# EAGLE design sensor_board4 (EAGLE 7.3.0)
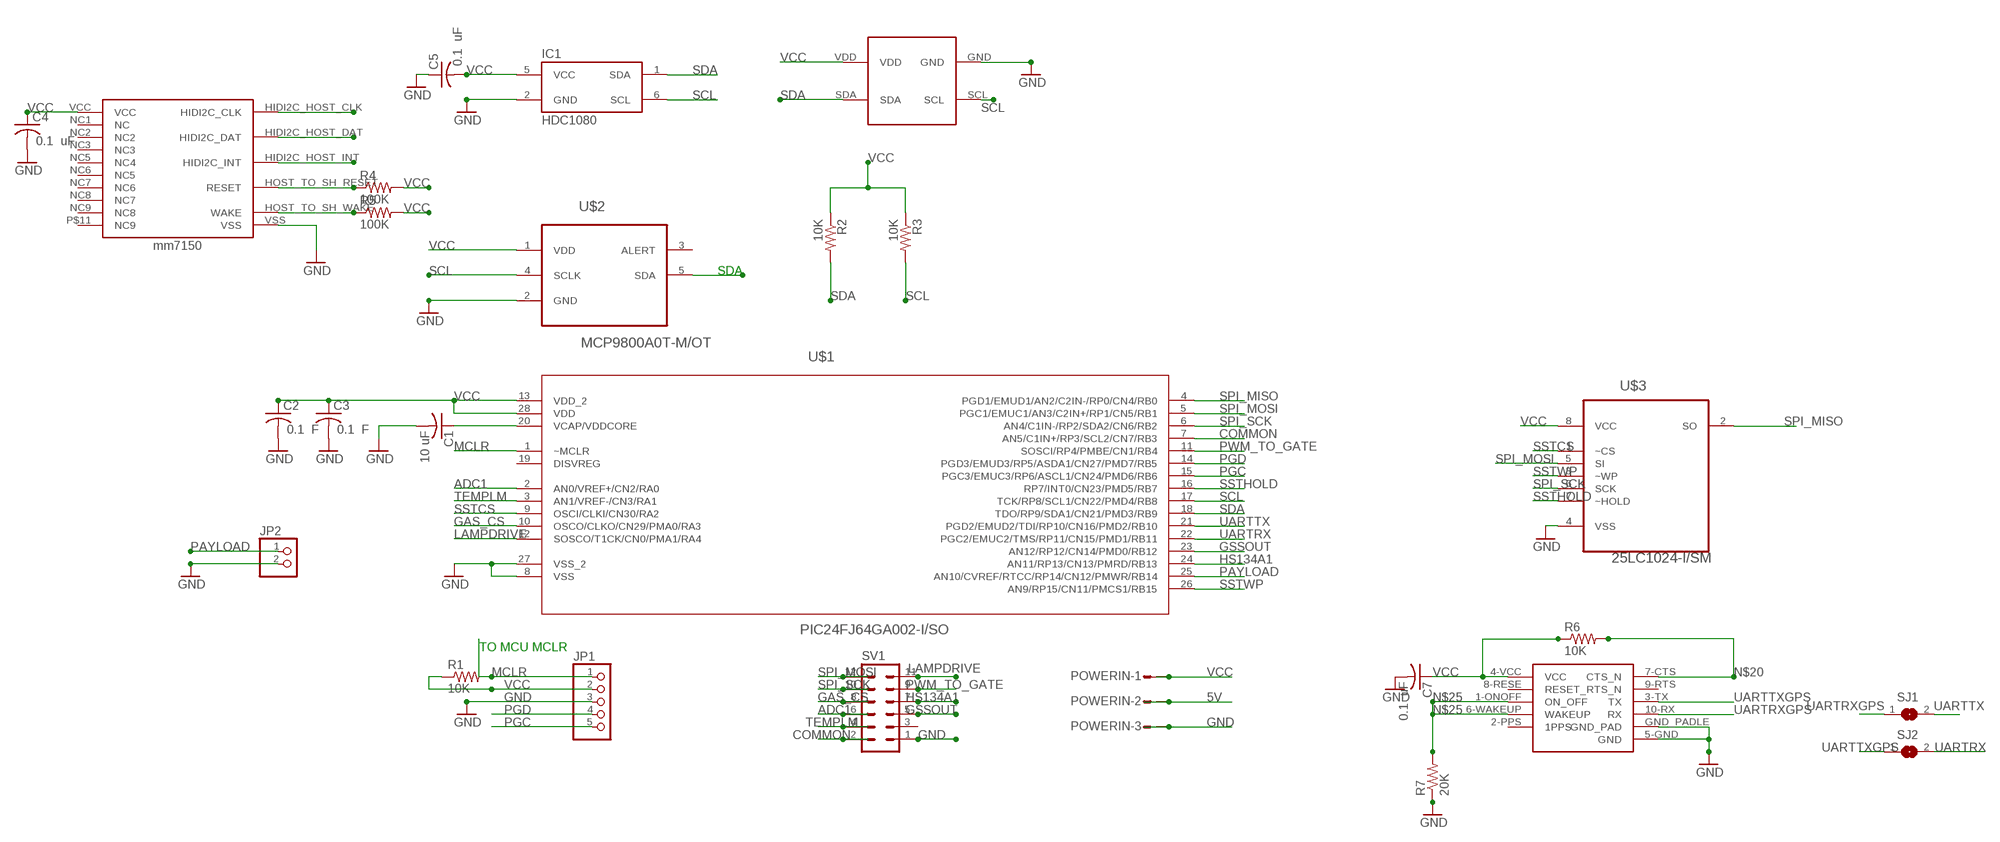
[diagram p0: schematic, sheet 1]

## Parts
C1  10 uF  C-USC0805  [C0805]
C2  0.1 F  C-USC0805  [C0805]
C3  0.1 F  C-USC0805  [C0805]
C4  0.1 uF  C-USC0805  [C0805]
C5  0.1 uF  C-USC0805  [C0805]
C7  0.1 uF  C-USC0805  [C0805]
IC1  HDC1080  [WSON6]
JP1  PINHD-1X5  [1X05]
JP2  PINHD-1X2  [1X02]
POWERIN  L03P  [L03P]
R1  10K  R-US_M0805  [M0805]
R2  10K  R-US_M0805  [M0805]
R3  10K  R-US_M0805  [M0805]
R4  100K  R-US_M0805  [M0805]
R5  100K  R-US_M0805  [M0805]
R6  10K  R-US_M0805  [M0805]
R7  20K  R-US_M0805  [M0805]
SJ1  SJ  [SJ]
SJ2  SJ  [SJ]
SV1  MA06-2  [MA06-2]
U$1  PIC24FJ64GA002-I/SO  [SOIC127P1030X265-28N]
U$2  MCP9800A0T-M/OT  [SOT95P280X145-5N]
U$3  25LC1024-I/SM  [SOIC127P794X203-8N]
U$4  MS5637  [MS5637]
U$5  ORG1411  [LGA]
U$6  MM7150  [MM7150-QFN16]

## Nets
5V: POWERIN.2
ADC1: SV1.6 U$1.2(AN0/VREF+/CN2/RA0)
COMMON: SV1.2 U$1.7(AN5/C1IN+/RP3/SCL2/CN7/RB3)
GAS_CS: SV1.8 U$1.10(OSCO/CLKO/CN29/PMA0/RA3)
GND: C1.2 C2.2 C3.2 C4.2 C5.1 C7.2 IC1.2(GND) JP1.3 JP2.2 POWERIN.3 R7.1 SV1.1 U$1.8(VSS) U$1.27(VSS_2) U$2.2(GND) U$3.4(VSS) U$4.GND U$5.5-GND(GND) U$5.GND_PADLE(GND_PAD) U$6.VSS
GSSOUT: SV1.5 U$1.23(AN12/RP12/CN14/PMD0/RB12)
HS134A1: SV1.7 U$1.24(AN11/RP13/CN13/PMRD/RB13)
LAMPDRIVE: SV1.11 U$1.12(SOSCO/T1CK/CN0/PMA1/RA4)
MCLR: JP1.1 R1.2 U$1.1(~MCLR)
N$2: C1.1 U$1.20(VCAP/VDDCORE)
N$5: U$6.HIDI2C_HOST_INT(HIDI2C_INT)
N$6: R4.1 U$6.HOST_TO_SH_RESET(RESET)
N$7: R5.1 U$6.HOST_TO_SH_WAKE(WAKE)
N$20: R6.2 U$5.7-CTS(CTS_N)
N$25: R7.2 U$5.1-ONOFF(ON_OFF) U$5.6-WAKEUP(WAKEUP)
PAYLOAD: JP2.1 U$1.25(AN10/CVREF/RTCC/RP14/CN12/PMWR/RB14)
PGC: JP1.5 U$1.15(PGC3/EMUC3/RP6/ASCL1/CN24/PMD6/RB6)
PGD: JP1.4 U$1.14(PGD3/EMUD3/RP5/ASDA1/CN27/PMD7/RB5)
PWM_TO_GATE: SV1.9 U$1.11(SOSCI/RP4/PMBE/CN1/RB4)
SCL: IC1.6(SCL) R3.2 U$1.17(TCK/RP8/SCL1/CN22/PMD4/RB8) U$2.4(SCLK) U$4.SCL U$6.HIDI2C_HOST_CLK(HIDI2C_CLK)
SDA: IC1.1(SDA) R2.2 U$1.18(TDO/RP9/SDA1/CN21/PMD3/RB9) U$2.5(SDA) U$4.SDA U$6.HIDI2C_HOST_DAT(HIDI2C_DAT)
SPI_MISO: U$1.4(PGD1/EMUD1/AN2/C2IN-/RP0/CN4/RB0) U$3.2(SO)
SPI_MOSI: SV1.12 U$1.5(PGC1/EMUC1/AN3/C2IN+/RP1/CN5/RB1) U$3.5(SI)
SPI_SCK: SV1.10 U$1.6(AN4/C1IN-/RP2/SDA2/CN6/RB2) U$3.6(SCK)
SSTCS: U$1.9(OSCI/CLKI/CN30/RA2) U$3.1(~CS)
SSTHOLD: U$1.16(RP7/INT0/CN23/PMD5/RB7) U$3.7(~HOLD)
SSTWP: U$1.26(AN9/RP15/CN11/PMCS1/RB15) U$3.3(~WP)
TEMPLM: SV1.4 U$1.3(AN1/VREF-/CN3/RA1)
UARTRX: SJ2.2 U$1.22(PGC2/EMUC2/TMS/RP11/CN15/PMD1/RB11)
UARTRXGPS: SJ1.1 U$5.10-RX(RX)
UARTTX: SJ1.2 U$1.21(PGD2/EMUD2/TDI/RP10/CN16/PMD2/RB10)
UARTTXGPS: SJ2.1 U$5.3-TX(TX)
VCC: C2.1 C3.1 C4.1 C5.2 C7.1 IC1.5(VCC) JP1.2 POWERIN.1 R1.1 R2.1 R3.1 R4.2 R5.2 R6.1 U$1.13(VDD_2) U$1.28(VDD) U$2.1(VDD) U$3.8(VCC) U$4.VDD U$5.4-VCC(VCC) U$6.VCC
Unconnected: SV1.3 U$1.19(DISVREG) U$2.3(ALERT) U$5.2-PPS(1PPS) U$5.8-RESE(RESET_) U$5.9-RTS(RTS_N) U$6.NC1(NC) U$6.NC2 U$6.NC3 U$6.NC5(NC4) U$6.NC6(NC5) U$6.NC7(NC6) U$6.NC8(NC7) U$6.NC9(NC8) U$6.P$11(NC9)

## Notes on the sheet
- SDA
- TO MCU MCLR

## Library data of the parts
C1-C5 C7 = rcl:C-US: CAPACITOR, American symbol
IC1 = we-sensor:HDC1080: TI HDC1080 Humidity and Temperature Sensor
JP1 = pinhead:PINHD-1X5: PIN HEADER
JP2 = pinhead:PINHD-1X2: PIN HEADER
POWERIN = con-amp-mt:L03P: AMP MT CONNECTOR; OC_FARNELL: unknown; OC_NEWARK: unknown
R1-R7 = resistor:R-US_: RESISTOR, American symbol
SJ1 SJ2 = jumper:SJ: SMD solder JUMPER
SV1 = con-lstb:MA06-2: PIN HEADER; OC_FARNELL: unknown; OC_NEWARK: unknown
U$1 = Microchip_By_element14_Batch_1:PIC24FJ64GA002-I/SO: 16-Bit Flash Microcontrollers; MPN: PIC24FJ64GA002-I/SO; OC_FARNELL: 1332297; OC_NEWARK: 88K6131; PACKAGE: SOIC-28; SUPPLIER: Microchip
U$2 = Microchip_By_element14_Batch_1:MCP9800A0T-M/OT: Temperature Sensor; MPN: MCP9800A0T-M/OT; OC_FARNELL: 1439485; OC_NEWARK: 58M8993; PACKAGE: SOT-5; SUPPLIER: MICROCHIP
U$3 = Microchip_By_element14_Batch_1:25LC1024-I/SM: 1 Mbit SPI Bus Serial EEPROM; MPN: 25LC1024-I/SM; OC_FARNELL: 1331393; OC_NEWARK: 89H3178; PACKAGE: SOIC-8; SUPPLIER: MICROCHIP
U$4 = MS5637:MS5637: Le MS563702BA03-50 est un Micro Altimètre ultra compact optimisé pour des applications d'altimètre et de baromètre dans des téléphones portables et des tablettes. La résolution d'altitude au niveau de la mer est de 13cm d'air. Le module de capteur comprend un capteur de pression haute linéarité et un CAN ΔΣ 24 bits ultra faible puissance avec des coefficients internes calibrés en usine. Il fournit une valeur numérique de pression et de température précise de 24 bits et différents modes de fonctionnement qui permettent à l'utilisateur d'optimiser la vitesse de conversion et la consommation de courant. La sortie de température à haute résolution permet la mise en œuvre d'une fonction altimètre / thermomètre sans capteur supplémentaire. Il peut être interfacé avec pratiquement tous les microcontrôleurs à interface I²C-bus. Le protocole de communication est simple, sans avoir à programmer des registres internes dans l'appareil. Faibles dimensions de 3 x 3 x 0.9mm³ pour une intégratio Module haute résolution, 13cm Capteur de pression numérique intégré (CAN ΔΣ 24 bits) Interface I²C Plage de pression étendue de 10 à 2000mbar Conversion rapide jusqu'à 0.5ms Faible consommation, 0.6µA (veille <=0.1µA à 25°C) Aucun composant externe (oscillateur interne)
U$5 = org1411:ORG1411: ORG1411 NanoHornet GPS module
U$6 = mm7150:MM7150

## Board
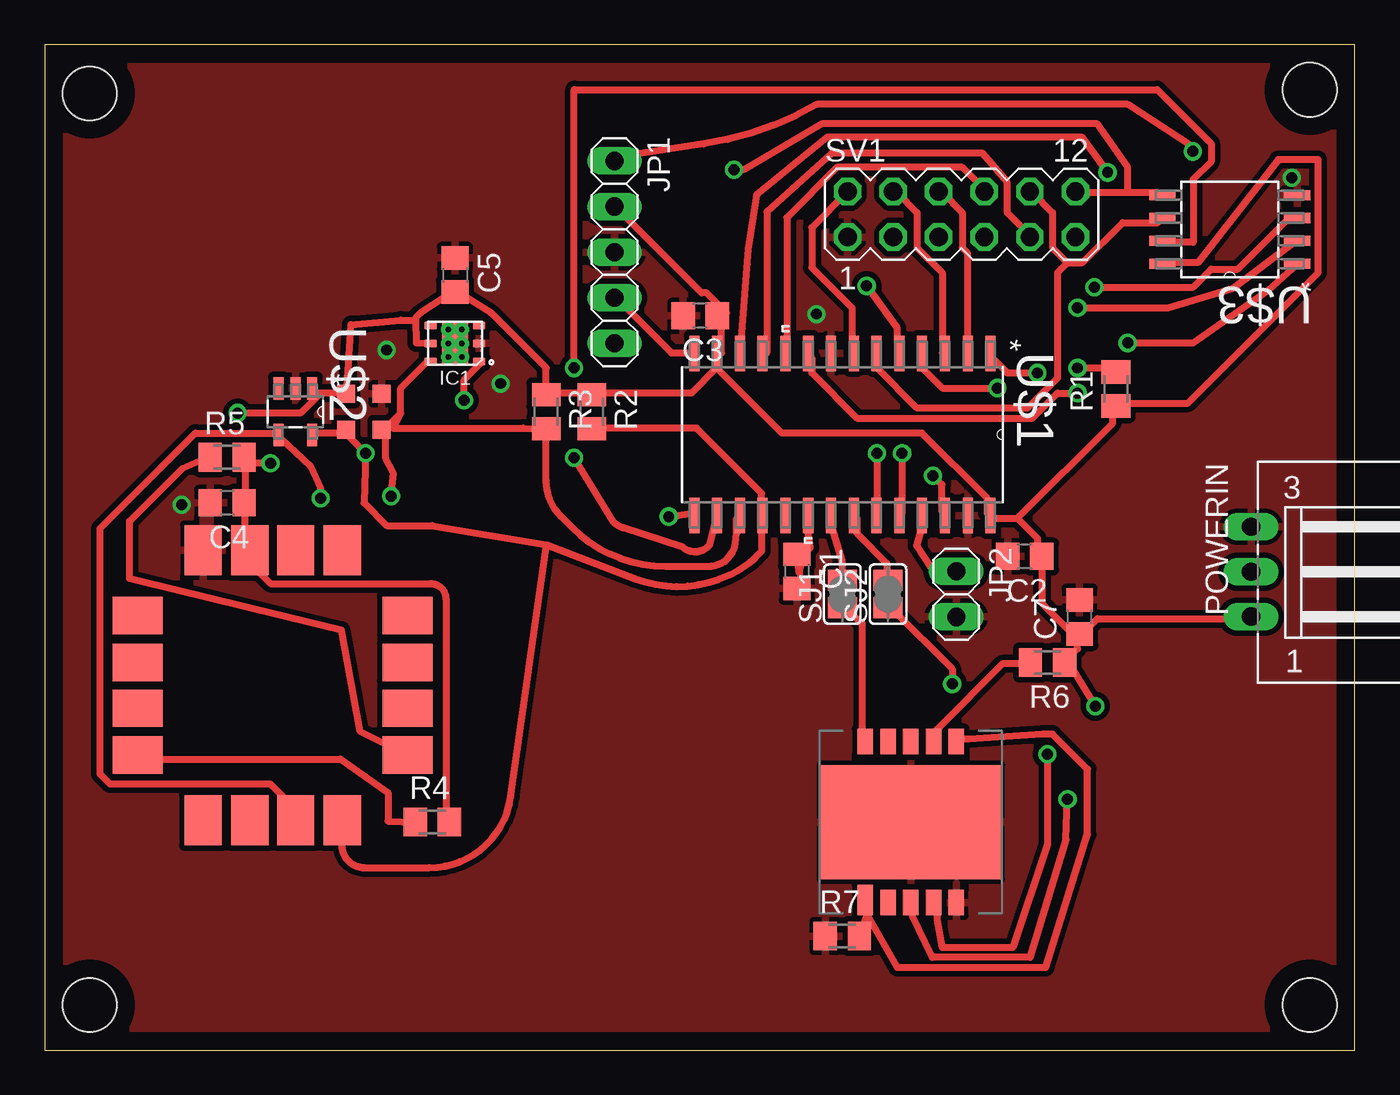
[diagram p1: board, top side]
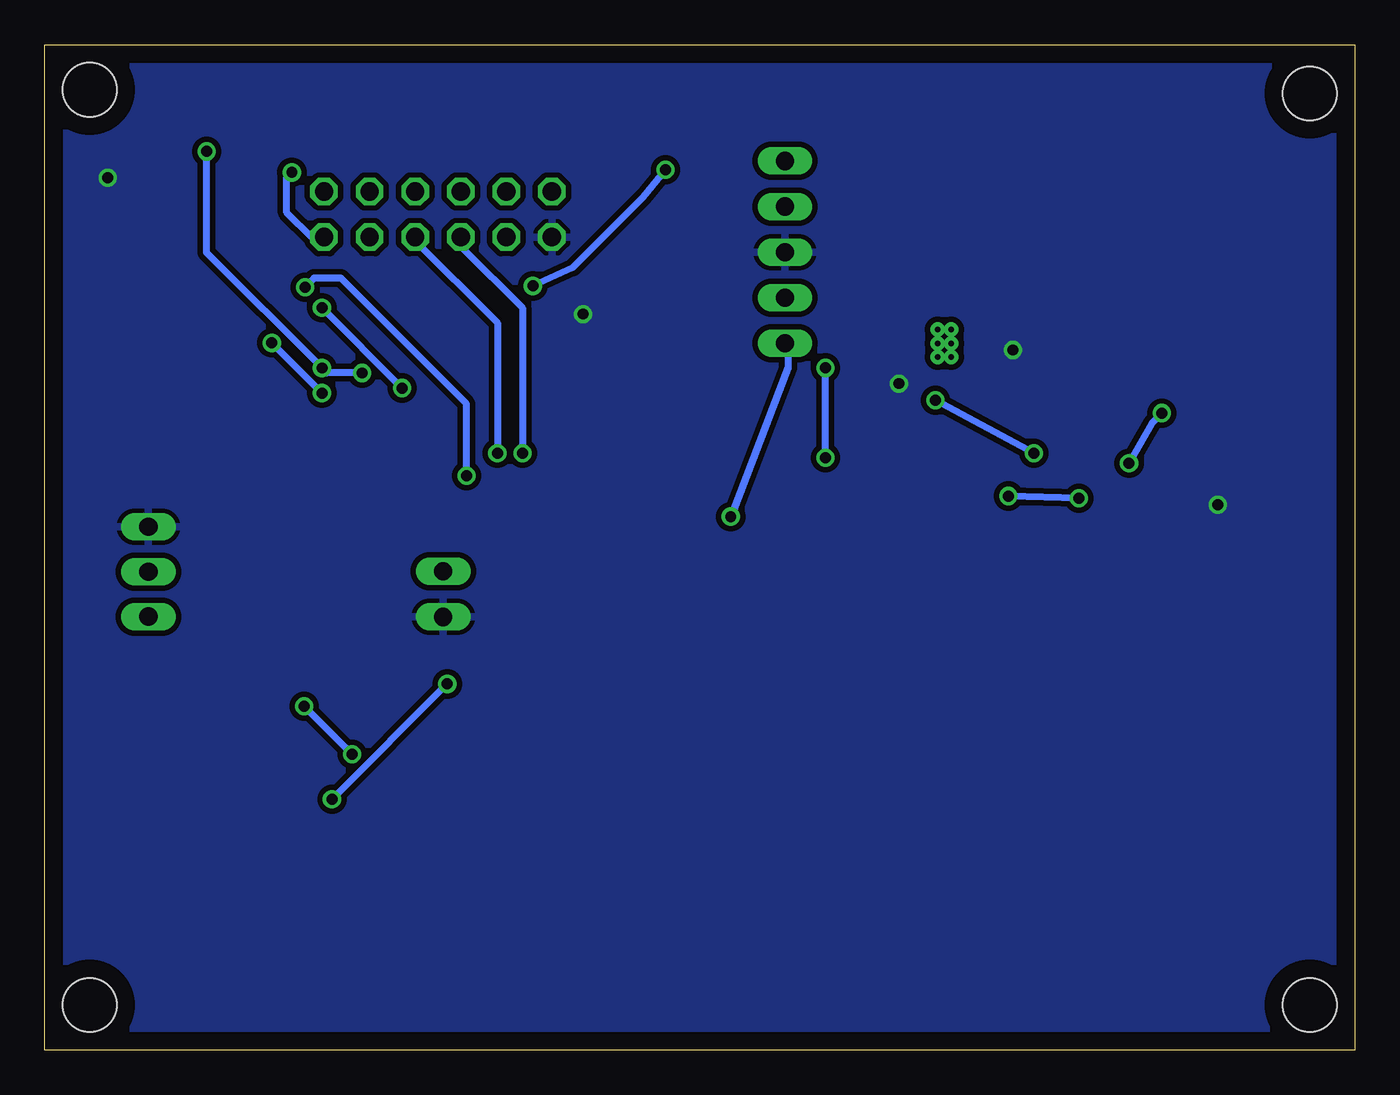
[diagram p2: board, bottom side, seen from below]

Size 73 x 56 mm. Coordinates in mm from the lower left corner, seen from the top.
Outline: 0,0 73,0 73,56 0,56 0,0
Copper layers (1*16): Top 0.035mm / dielectric 1.5mm / Bottom 0.035mm
Design rules "default *": minimum track width 10mil, minimum drill 24mil, track to track 12mil, track to pad 12mil, pad to pad 12mil, via to via 12mil, smd to smd 12mil, copper to edge 40mil, drill to drill 8mil, minimum pad ring 10mil, minimum via ring 8mil, stop-mask expansion 4mil, vias tented up to drill 0mil, thermal gap 10mil
Holes 3 mm at 2.5,2.5 2.5,53.3 70.5,53.5 70.5,2.5

### Footprints (pad centres in the part's own frame; a part is rotated, then mirrored left to right if it is on the bottom)
C0805 = smd 1.3 x 1.5: 1 -0.95,0; 2 0.95,0
WSON6 = smd 0.7 x 0.45: 1 -1.35,1; 2 -1.35,0; 3 -1.35,-1; 4 1.35,-1; 5 1.35,0; 6 1.35,1 | drill 0.3 pad 0.7: P$2 -0.381,0.762; P$3 0.381,0.762; P$4 -0.381,0; P$5 -0.381,-0.762; P$7 0.381,-0.762 | drill 0.3 pad 0.61: P$6 0.381,0 | smd 1.5 x 2.4: TP 0,0
1X05 = drill 1.016 long: 1 -5.08,0; 2 -2.54,0; 3 0,0; 4 2.54,0; 5 5.08,0
1X02 = drill 1.016 long: 1 -1.27,0; 2 1.27,0
L03P = drill 1.016 long: 1 2.5,-6.25; 2 0,-6.25; 3 -2.5,-6.25
M0805 = smd 1.3 x 1.6: 1 -0.95,0; 2 0.95,0
SJ = smd 1.168 x 1.6: 1 -0.762,0; 2 0.762,0
MA06-2 = drill 1.016 octagon: 1 -6.35,-1.27; 2 -6.35,1.27; 3 -3.81,-1.27; 4 -3.81,1.27; 5 -1.27,-1.27; 6 -1.27,1.27; 7 1.27,-1.27; 8 1.27,1.27; 9 3.81,-1.27; 10 3.81,1.27; 11 6.35,-1.27; 12 6.35,1.27
SOIC127P1030X265-28N = smd 1.981 x 0.559: 1 -4.521,8.255; 2 -4.521,6.985; 3 -4.521,5.715; 4 -4.521,4.445; 5 -4.521,3.175; 6 -4.521,1.905; 7 -4.521,0.635; 8 -4.521,-0.635; 9 -4.521,-1.905; 10 -4.521,-3.175; 11 -4.521,-4.445; 12 -4.521,-5.715; 13 -4.521,-6.985; 14 -4.521,-8.255; 15 4.521,-8.255; 16 4.521,-6.985; 17 4.521,-5.715; 18 4.521,-4.445; 19 4.521,-3.175; 20 4.521,-1.905; 21 4.521,-0.635; 22 4.521,0.635; 23 4.521,1.905; 24 4.521,3.175; 25 4.521,4.445; 26 4.521,5.715; 27 4.521,6.985; 28 4.521,8.255
SOT95P280X145-5N = smd 1.27 x 0.559: 1 -1.295,0.94; 2 -1.295,0; 3 -1.295,-0.94; 4 1.295,-0.94; 5 1.295,0.94
SOIC127P794X203-8N = smd 1.473 x 0.559: 1 -3.759,1.905; 2 -3.759,0.635; 3 -3.759,-0.635; 4 -3.759,-1.905; 5 3.759,-1.905; 6 3.759,-0.635; 7 3.759,0.635; 8 3.759,1.905
MS5637 = smd 1 x 1: GND 1,1; SCL 1,-1; SDA -1,-1; VDD -1,1
LGA = smd 1.676 x 0.864: 1-ONOFF 4.343,-2.54 | smd 1.422 x 0.864: 2-PPS 4.483,-1.27; 3-TX 4.483,0; 4-VCC 4.483,1.27; 5-GND 4.483,2.54; 6-WAKEUP -4.483,2.54; 7-CTS -4.483,1.27; 8-RESE -4.483,0; 9-RTS -4.483,-1.27; 10-RX -4.483,-2.54 | smd 6.35 x 10.008: GND_PADLE 0,0
MM7150-QFN16 = smd 2.8 x 2.08: HIDI2C_HOST_CLK -7.52,-1.275; HIDI2C_HOST_DAT -7.52,-3.88; NC5 -7.52,3.88; NC6 -7.52,1.275; NC8 7.52,-3.88; NC9 7.52,-1.275; VCC 7.52,1.275; VSS 7.52,3.88 | smd 2.08 x 2.8: HIDI2C_HOST_INT 3.88,-7.52; HOST_TO_SH_RESET -3.88,7.52; HOST_TO_SH_WAKE -3.88,-7.52; NC1 1.275,7.52; NC2 -1.275,-7.52; NC3 3.88,7.52; NC7 1.275,-7.52; P$11 -1.275,7.52

### Placement (x,y rotation side)
C1  41.91,26.67 270 top
C2  54.61,27.5 180 top
C3  36.53,40.91 180 top
C4  10.16,30.48 180 top
C5  22.86,43.18 270 top
C7  57.67,24.13 90 top
IC1  22.86,39.37 180 top
JP1  31.75,44.45 270 top
JP2  50.8,25.4 270 top
POWERIN  73.48,26.65 270 top
R1  59.69,36.83 90 top
R2  30.48,35.56 270 top
R3  27.94,35.56 270 top
R4  21.59,12.7 0 top
R5  10.16,33.02 0 top
R6  55.88,21.59 180 top
R7  44.45,6.35 0 top
SJ1  44.45,25.4 90 top
SJ2  46.99,25.4 90 top
SV1  51.09,46.56 0 top
U$1  44.45,34.29 270 top
U$2  13.97,35.56 270 top
U$3  66.04,45.72 180 top
U$4  17.78,35.56 0 top
U$5  48.26,12.7 270 top
U$6  12.7,20.32 90 top

### Tracks (layer width: path | path; a pad name or v marks a point on that pad's centre or on a via)
ADC1
  Top 0.4: U$1.2 51.41,38.84 51.41,44.42 51.13,44.7 51.13,46.66 50.01,47.78 SV1.6
COMMON
  Top 0.4: U$1.7 44.98,38.84 44.98,41.35 42.75,43.59 42.75,45.82 44.7,47.78 SV1.2
GAS_CS
  Top 0.4: U$1.10 41.35,38.84 41.35,46.38 44.15,49.17 51.13,49.17 52.25,48.06 SV1.8
GND  (via drill 0.6, 0.6 pad 0.3)
  Top 0.4: U$4.GND 19.05,36.56 19.05,36.83
  other vias: 43,41 69.5,48.6 25.4,37.13 7.62,30.38 19.05,39
  pour Bottom: 0,55.88 72.39,55.88 72.39,0 0,0 0,1.27
  pour Bottom: 0,55.88 72.39,55.88 72.39,53.34 72.39,0 0,0 0,1.27
  pour Top: 0,55.88 72.39,55.88 72.39,0 0,0 0,1.27
GSSOUT  (via drill 0.61)
  Top 0.4: v46.38,33.25 46.38,29.9 U$1.23
  Bottom 0.4: v46.38,33.25 46.38,41.35 49.73,44.7 49.73,45.26 SV1.5
HS134A1  (via drill 0.61)
  Top 0.4: v47.78,33.25 47.78,29.9 U$1.24
  Bottom 0.4: v47.78,33.25 47.78,40.51 52.53,45.26 SV1.7
LAMPDRIVE  (via drill 0.61)
  Top 0.4: v59.23,48.9 57.84,50.84 43.59,50.84 39.67,47.65 39.2,44.6 38.84,39.95 38.84,38.84 U$1.12
  Bottom 0.4: v59.23,48.9 59.51,48.62 59.51,46.66 58.12,45.26 57.56,45.26 SV1.11
MCLR  (via drill 0.61)
  Top 0.4: v57.56,38 59.51,38 R1.2 | v55.32,37.72 53.65,37.72 52.81,38.56 U$1.1 | v63.98,50.06 63.98,50.32 60.35,52.68 43.03,52.68 arc-21 36.73,50.49 31.85,49.73 JP1.1
  Bottom 0.4: v55.32,37.72 57.28,37.72 v57.56,38 63.98,44.42 v63.98,50.06
N$2
  Top 0.4: C1.1 42.06,26.54 arc-45 42.66,27.97 42.47,29.06 42.47,29.62 U$1.20
N$6
  Top 0.4: R4.1 19.13,12.75 19.13,14.33 16.48,16.2 5.31,16.2 U$6.HOST_TO_SH_RESET
N$7
  Top 0.4: R5.1 8.94,32.97 7.67,32.41 4.72,29.46 4.72,26.26 16.54,23.39 17.58,17.75 U$6.HOST_TO_SH_WAKE
N$20
  Top 0.4: U$5.7-CTS 49.73,17.32 49.73,17.88 53.37,21.51 54.76,21.51 R6.2
N$25
  Top 0.4: 45.82,7.54 47.5,4.6 55.78,4.6 58.12,12.01 58.12,15.65 56.16,17.6 55.6,17.6 51.51,17.32 50.85,17.32 U$5.6-WAKEUP | 45.82,7.54 45.82,8.1 U$5.1-ONOFF | 45.82,7.54 R7.2
PAYLOAD
  Top 0.4: U$1.25 48.9,29.06 48.59,28.09 49.43,26.82 JP2.1
PGC  (via drill 0.61)
  Top 0.4: v34.77,29.72 36.04,29.9 U$1.15
  Bottom 0.4: v34.77,29.72 31.57,38 31.57,39.12 JP1.5
PGD
  Top 0.4: U$1.14 36.04,38.84 34.92,38.84 31.85,41.91 JP1.4
PWM_TO_GATE
  Top 0.4: U$1.11 40.23,38.84 40.23,46.7 43.87,49.97 52.25,49.97 53.65,48.34 53.65,46.66 54.76,45.54 SV1.9
SCL  (via drill 0.61)
  Top 0.4: 19.84,35.48 19.84,36.88 21.23,38.28 IC1.6 | 19.84,35.48 19,34.65 U$4.SCL 19,34.37 19,32.97 19.43,32.13 v19.3,30.86 | 19.84,35.48 19.41,34.65 26.67,34.65 R3.2 27.94,31.72 arc45 28.76,29.73 29.38,29.11 arc45 34.6,26.95 37,26.95 arc82 38.48,28.24 38.56,28.78 38.56,29.62 U$1.17 | U$6.HIDI2C_HOST_CLK 13.97,12.85 13.97,13.41 12.57,14.81 3.63,14.81 3.07,15.37 3.07,29.06 8.38,34.37 12.85,34.37 U$2.4 13.13,34.09 14.81,32.51 15.37,31.29 v15.37,30.73
  Bottom 0.4: v15.37,30.73 v19.3,30.86
SDA  (via drill 0.61)
  Top 0.4: v23.37,36.2 23.37,37.34 24.31,38.28 IC1.1 | 16.76,34.37 v17.88,33.25 17.78,30.48 19.05,29.21 21.59,29.21 27.97,28.15 | 16.76,34.37 15.09,34.37 U$2.5 | 16.76,34.37 U$4.SDA | R2.2 30.73,34.65 36.32,34.65 39.95,31.01 39.95,29.9 U$1.18 39.95,29.62 39.95,27.79 39.59,27.43 arc-10 39.17,27.07 arc-56 32.88,26.27 27.97,28.15 | U$6.HIDI2C_HOST_DAT 16.55,11.46 arc92 17.81,10.16 21.43,10.16 arc82 25.96,14.09 27.97,28.15
  Bottom 0.4: v17.88,33.25 v23.37,36.2
SPI_MISO  (via drill 0.61)
  Top 0.4: v57.56,41.35 62.59,41.35 66.22,42.44 69.57,44.98 U$3.2 | v53.09,36.88 50.01,36.88 48.9,38 U$1.4
  Bottom 0.4: v53.09,36.88 v57.56,41.35
SPI_MOSI  (via drill 0.61)
  Top 0.4: 60.35,47.78 57.56,47.78 SV1.12 | 60.35,47.78 62.03,47.78 U$3.5 | v45.8,42.57 47.5,40.23 47.5,38.84 U$1.5 | v38.41,49.05 38.96,49.05 43.31,51.6 58.67,51.6 60.35,49.17 60.35,47.78
  Bottom 0.4: v45.8,42.57 43.59,43.59 39.67,47.5 v38.41,49.05
SPI_SCK
  Top 0.4: 57,43.87 57.84,43.87 60.07,46.1 62.03,46.1 U$3.6 | 57,43.87 56.16,44.7 56.16,46.66 55.04,47.78 SV1.10 | 57,43.87 56.44,43.31 56.44,37.44 54.76,35.76 48.62,35.76 46.38,38 46.38,38.56 U$1.6
SSTCS  (via drill 0.61)
  Top 0.4: v60.35,39.4 64.01,39.4 68.2,42.32 69.57,43.59 U$3.1 | v57.56,36.6 56.44,36.6 55.04,35.2 45.26,35.2 42.75,37.72 42.75,38.56 U$1.9
  Bottom 0.4: v57.56,36.6 v60.35,39.4
SSTHOLD  (via drill 0.61)
  Top 0.4: v29.5,38 29.5,53.5 62,53.5 65,50.5 65,49.5 64,48.5 64,45 62.5,45 U$3.7 | v29.5,33 31.7,29.42 arc28 32.22,29.09 35.55,28.02 arc94 37.04,28.14 37.5,30 U$1.16
  Bottom 0.4: v29.5,33 v29.5,38
SSTWP  (via drill 0.61)
  Top 0.4: v58.5,42.5 64,42.5 65,43.5 66.5,43.5 69.5,46.5 U$3.3 | v49.5,32 50,31.5 50,30 U$1.26
  Bottom 0.4: v58.5,42.5 58,43 56.5,43 49.5,36 v49.5,32
TEMPLM
  Top 0.4: U$1.3 50.01,38.84 50.01,43.31 48.62,44.7 48.62,46.66 47.5,47.78 SV1.4
UARTRX
  Top 0.4: SJ2.2 46.94,26.26 46.94,27.1 45.26,28.78 45.26,29.62 U$1.22
UARTRXGPS
  Top 0.4: U$5.10-RX 45.54,17.32 45.54,23.75 44.7,24.59 SJ1.1
UARTTX
  Top 0.4: SJ1.2 44.42,26.26 44.42,27.23 43.87,29.06 43.87,29.62 U$1.21
UARTTXGPS  (via drill 0.61)
  Top 0.4: v57,13.97 56.91,11.73 54.9,5.16 49.45,5.16 48.34,7.54 48.34,8.1 U$5.3-TX | v50.57,20.4 50.57,21.23 47.22,24.59 SJ2.1
  Bottom 0.4: v50.57,20.4 v57,13.97
VCC  (via drill 0.61)
  Top 0.4: 11.18,32.69 11.18,32.97 R5.2 11.18,32.69 | 11.18,32.69 11.18,30.73 C4.1 11.18,30.45 11.18,27.94 U$6.VCC 11.46,27.66 11.46,27.1 12.57,25.98 21.5,25.98 arc-90 22.35,25.13 22.35,12.75 R4.2 | 20.68,40.66 19.84,40.66 17.04,40.41 U$4.VDD 16.76,36.6 15.37,36.6 | 20.68,40.66 20.7,39.4 IC1.5 | 15.37,36.6 15.09,36.6 U$2.1 | 27.94,36.6 30.45,36.6 R2.1 30.73,36.6 36.04,36.6 37.44,38 | U$1.13 37.72,38.84 37.72,40.79 C3.1 38,41.07 36.88,42.19 36.6,42.19 31.85,46.94 JP1.2 | 37.44,38 37.44,38.56 U$1.13 | 20.68,40.66 20.68,40.79 20.95,41.07 22.86,42.34 | 22.86,42.34 24.87,41.07 27.94,38 27.94,36.6 | 27.94,36.6 R3.1 | U$3.8 62.31,43.87 64.26,43.87 68.73,49.61 70.97,49.61 70.97,43.31 63.7,36.04 59.79,36.04 R1.1 59.51,35.76 59.51,34.92 54.2,29.62 | 54.2,29.62 55.32,28.5 55.32,27.94 C2.1 55.6,27.94 55.6,24.87 57.56,22.91 | 54.2,29.62 52.81,29.62 U$1.28 52.53,29.9 52.53,30.73 48.9,34.37 41.07,34.37 37.44,38 | v55.88,16.48 55.88,11.46 53.95,5.71 50.01,5.71 49.73,7.26 49.73,8.1 U$5.4-VCC | v58.55,19.15 57.28,21.23 57,21.51 R6.1 57,21.79 57.56,22.35 57.56,22.91 | POWERIN.1 67.06,24.03 58.67,24.03 57.84,23.19 C7.1 57.56,22.91 | 37.44,38 U$1.13 | v12.57,32.69 11.18,32.69 | v10.74,35.48 14.25,35.48 15.37,36.6 | C5.2 22.86,42.34
  Bottom 0.4: v58.55,19.15 v55.88,16.48 | v12.57,32.69 11.3,34.92 v10.74,35.48